# Altium schematic sheet Top Level.SchDoc
size A3; SheetNumber: 1; SheetTotal: 10
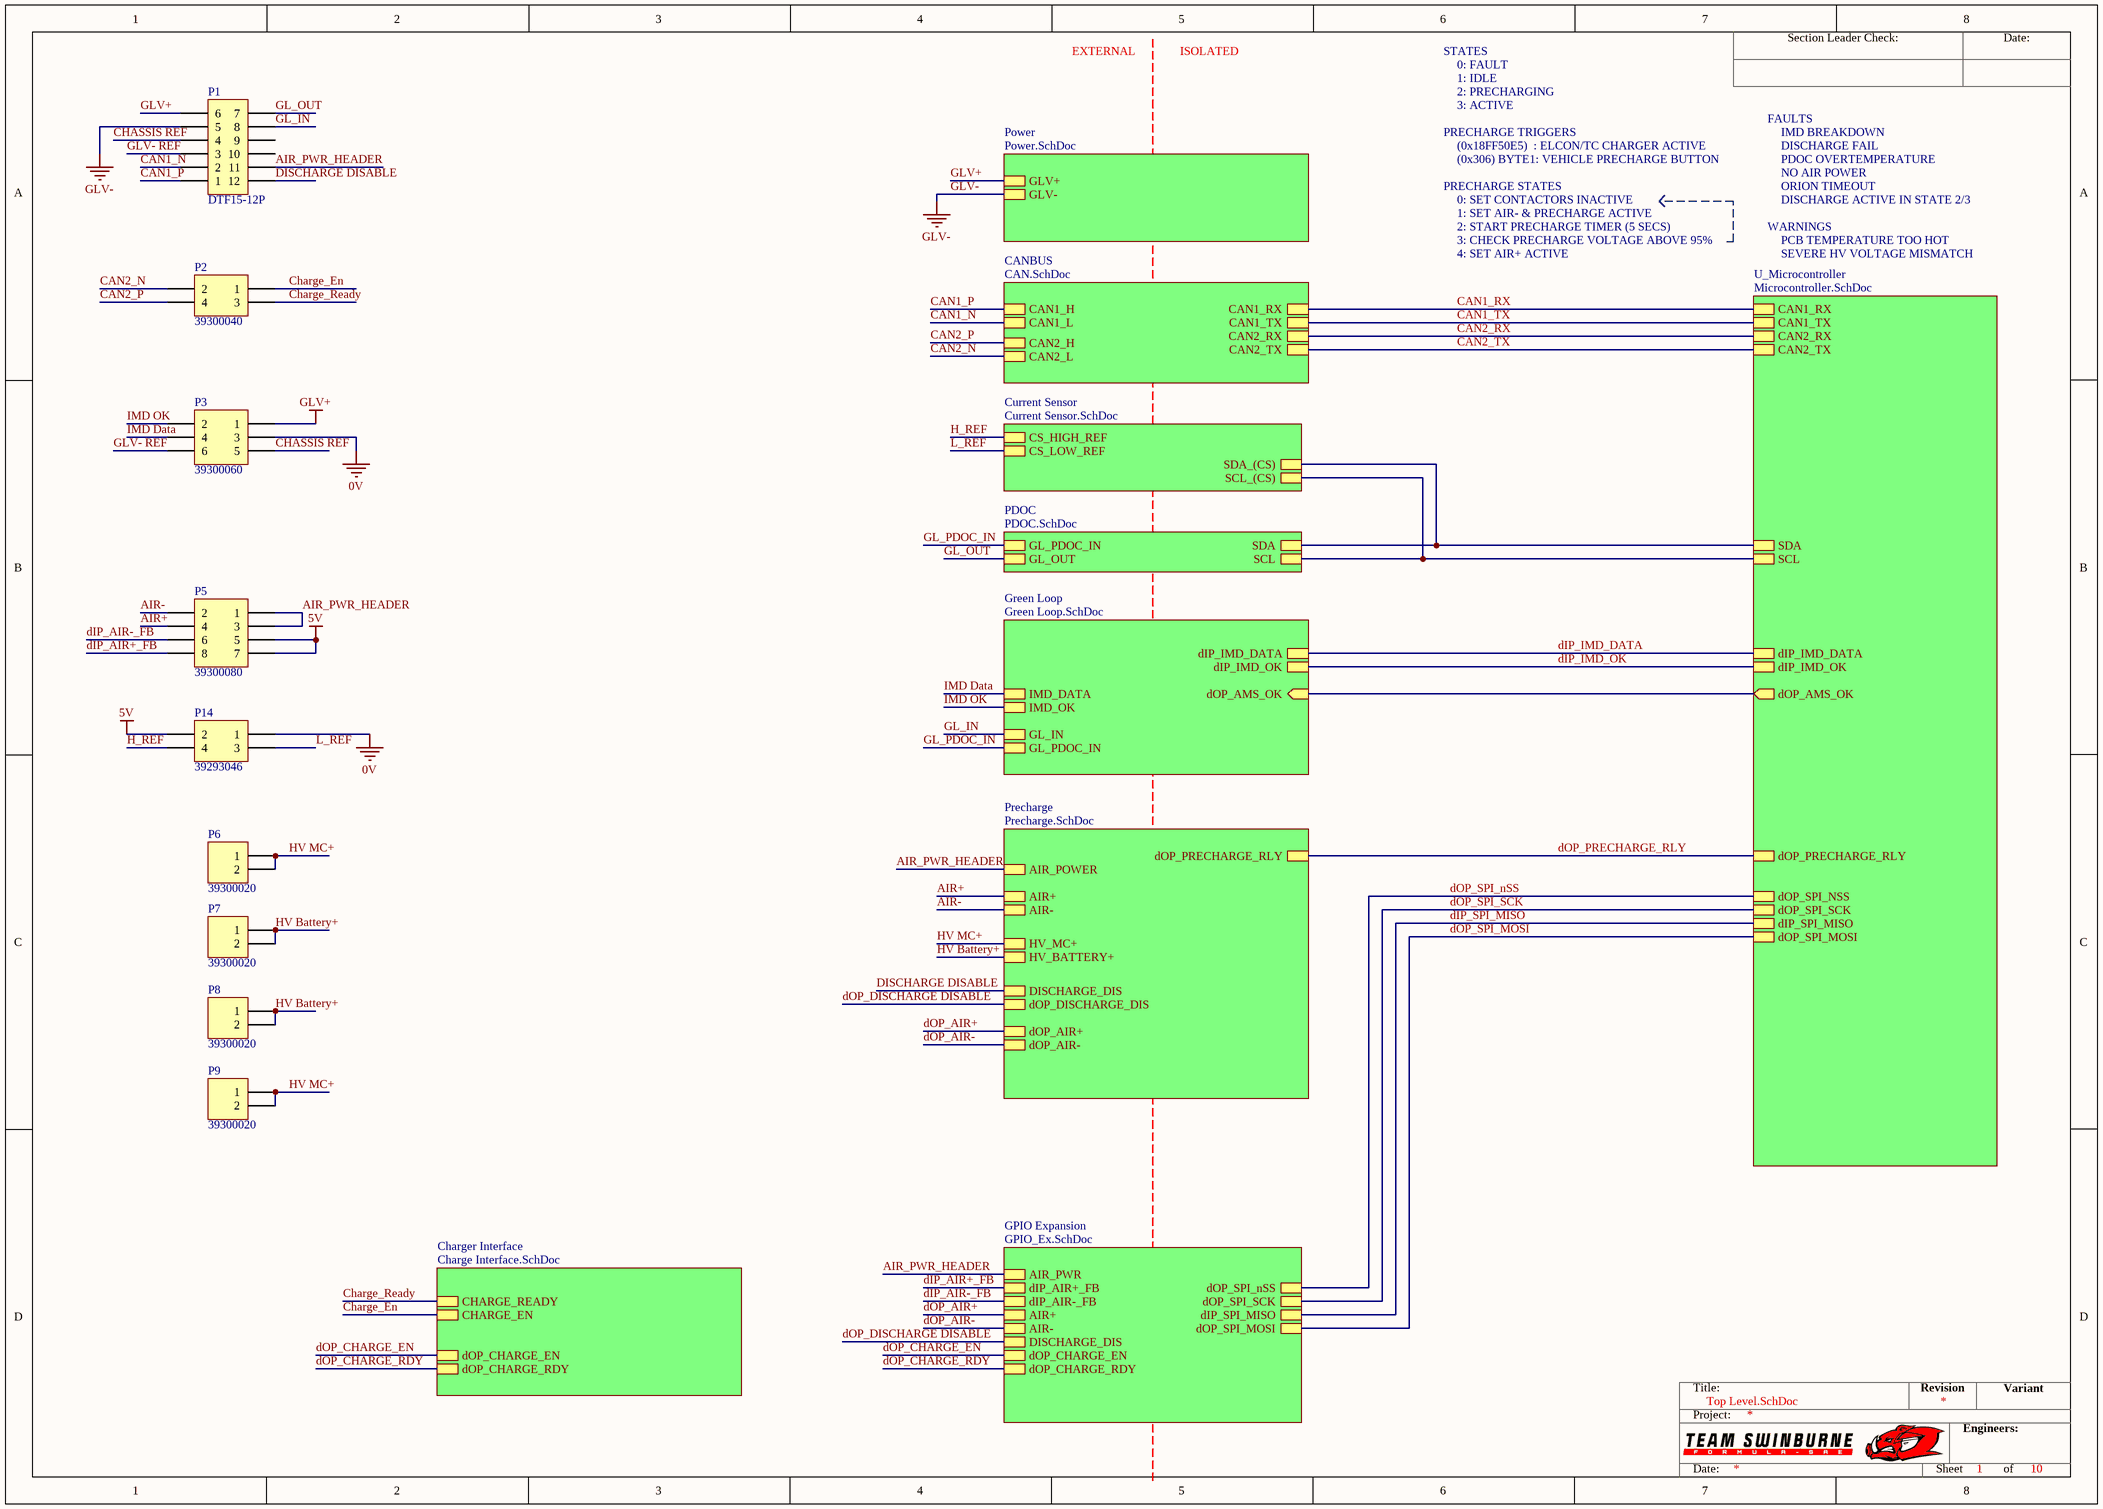
[diagram p0: Top Level.SchDoc]

## Parts
P1  DTF15-12P  [DTF15-12P]
P2  39300040  [39300040]
P3  39300060  [39300060]
P5  39300080  [39300080]
P6  39300020  [39300020]
P7  39300020  [39300020]
P8  39300020  [39300020]
P9  39300020  [39300020]
P14  39293046  [39293046]

## Sub-sheets
CANBUS = CAN.SchDoc: CAN1_RX, CAN1_TX, CAN2_RX, CAN2_TX, CAN1_H, CAN1_L, CAN2_H, CAN2_L
Charger Interface = Charge Interface.SchDoc: CHARGE_READY, CHARGE_EN, dOP_CHARGE_EN, dOP_CHARGE_RDY
Current Sensor = Current Sensor.SchDoc: SCL_(CS), CS_HIGH_REF, CS_LOW_REF, SDA_(CS)
GPIO Expansion = GPIO_Ex.SchDoc: dOP_SPI_nSS, dOP_SPI_SCK, dIP_SPI_MISO, dOP_SPI_MOSI, AIR_PWR, dIP_AIR+_FB, dIP_AIR-_FB, AIR+, AIR-, dOP_CHARGE_RDY, dOP_CHARGE_EN, DISCHARGE_DIS
Green Loop = Green Loop.SchDoc: dIP_IMD_DATA, dIP_IMD_OK, GL_IN, GL_PDOC_IN, IMD_DATA, IMD_OK, dOP_AMS_OK (in)
PDOC = PDOC.SchDoc: SDA, SCL, GL_PDOC_IN, GL_OUT
Power = Power.SchDoc: GLV+, GLV-
Precharge = Precharge.SchDoc: dOP_AIR-, dOP_AIR+, dOP_PRECHARGE_RLY, DISCHARGE_DIS, AIR+, AIR-, HV_MC+, HV_BATTERY+, dOP_DISCHARGE_DIS, AIR_POWER
U_Microcontroller = Microcontroller.SchDoc: CAN1_RX, CAN1_TX, CAN2_RX, CAN2_TX, dOP_PRECHARGE_RLY, dOP_SPI_NSS, dOP_SPI_SCK, dIP_SPI_MISO, dOP_SPI_MOSI, dIP_IMD_DATA, dIP_IMD_OK, SDA, SCL, dOP_AMS_OK (out)

## Nets
0V: P3.3 P14.1
5V: P5.5 P5.7 P14.2
GLV+: P1.6 P3.1 ; sheet Power/GLV+
GLV-: P1.5 ; sheet Power/GLV-
AIR+: P5.4 ; sheet Precharge/AIR+
AIR-: P5.2 ; sheet Precharge/AIR-
AIR_PWR_HEADER: P1.11 P5.1 P5.3 ; sheet Precharge/AIR_POWER, sheet GPIO Expansion/AIR_PWR
CAN1_N: P1.2 ; sheet CANBUS/CAN1_L
CAN1_P: P1.1 ; sheet CANBUS/CAN1_H
CAN1_RX: sheet U_Microcontroller/CAN1_RX, sheet CANBUS/CAN1_RX
CAN1_TX: sheet U_Microcontroller/CAN1_TX, sheet CANBUS/CAN1_TX
CAN2_N: P2.2 ; sheet CANBUS/CAN2_L
CAN2_P: P2.4 ; sheet CANBUS/CAN2_H
CAN2_RX: sheet U_Microcontroller/CAN2_RX, sheet CANBUS/CAN2_RX
CAN2_TX: sheet U_Microcontroller/CAN2_TX, sheet CANBUS/CAN2_TX
Charge_En: P2.1 ; sheet Charger Interface/CHARGE_EN
Charge_Ready: P2.3 ; sheet Charger Interface/CHARGE_READY
CHASSIS REF: P1.4 P3.5
dIP_AIR+_FB: P5.8 ; sheet GPIO Expansion/dIP_AIR+_FB
dIP_AIR-_FB: P5.6 ; sheet GPIO Expansion/dIP_AIR-_FB
dIP_IMD_DATA: sheet U_Microcontroller/dIP_IMD_DATA, sheet Green Loop/dIP_IMD_DATA
dIP_IMD_OK: sheet U_Microcontroller/dIP_IMD_OK, sheet Green Loop/dIP_IMD_OK
dIP_SPI_MISO: sheet U_Microcontroller/dIP_SPI_MISO, sheet GPIO Expansion/dIP_SPI_MISO
DISCHARGE DISABLE: P1.12 ; sheet Precharge/DISCHARGE_DIS
dOP_AIR+: sheet Precharge/dOP_AIR+, sheet GPIO Expansion/AIR+
dOP_AIR-: sheet Precharge/dOP_AIR-, sheet GPIO Expansion/AIR-
dOP_CHARGE_EN: sheet Charger Interface/dOP_CHARGE_EN, sheet GPIO Expansion/dOP_CHARGE_EN
dOP_CHARGE_RDY: sheet Charger Interface/dOP_CHARGE_RDY, sheet GPIO Expansion/dOP_CHARGE_RDY
dOP_DISCHARGE DISABLE: sheet Precharge/dOP_DISCHARGE_DIS, sheet GPIO Expansion/DISCHARGE_DIS
dOP_PRECHARGE_RLY: sheet U_Microcontroller/dOP_PRECHARGE_RLY, sheet Precharge/dOP_PRECHARGE_RLY
dOP_SPI_MOSI: sheet U_Microcontroller/dOP_SPI_MOSI, sheet GPIO Expansion/dOP_SPI_MOSI
dOP_SPI_nSS: sheet U_Microcontroller/dOP_SPI_NSS, sheet GPIO Expansion/dOP_SPI_nSS
dOP_SPI_SCK: sheet U_Microcontroller/dOP_SPI_SCK, sheet GPIO Expansion/dOP_SPI_SCK
GL_IN: P1.8 ; sheet Green Loop/GL_IN
GL_OUT: P1.7 ; sheet PDOC/GL_OUT
GL_PDOC_IN: sheet Green Loop/GL_PDOC_IN, sheet PDOC/GL_PDOC_IN
GLV- REF: P1.3 P3.6
H_REF: P14.4 ; sheet Current Sensor/CS_HIGH_REF
HV Battery+: P7.1 P7.2 P8.1 P8.2 ; sheet Precharge/HV_BATTERY+
HV MC+: P6.1 P6.2 P9.1 P9.2 ; sheet Precharge/HV_MC+
IMD Data: P3.4 ; sheet Green Loop/IMD_DATA
IMD OK: P3.2 ; sheet Green Loop/IMD_OK
L_REF: P14.3 ; sheet Current Sensor/CS_LOW_REF
(unnamed): sheet U_Microcontroller/SDA, sheet PDOC/SDA, sheet Current Sensor/SDA_(CS)
(unnamed): sheet U_Microcontroller/SCL, sheet PDOC/SCL, sheet Current Sensor/SCL_(CS)
(unnamed): sheet U_Microcontroller/dOP_AMS_OK, sheet Green Loop/dOP_AMS_OK

Not connected (* = marked no-connect by the designer): P1 9 10

## Notes on the sheet
- EXTERNAL
- ISOLATED
- STATES
- 0: FAULT
- 1: IDLE
- 2: PRECHARGING
- 3: ACTIVE
- PRECHARGE TRIGGERS
- (0x18FF50E5)  : ELCON/TC CHARGER ACTIVE
- (0x306) BYTE1: VEHICLE PRECHARGE BUTTON
- FAULTS
- IMD BREAKDOWN
- DISCHARGE FAIL
- PDOC OVERTEMPERATURE
- NO AIR POWER
- PRECHARGE STATES
- 1: SET AIR- & PRECHARGE ACTIVE
- 2: START PRECHARGE TIMER (5 SECS)
- 3: CHECK PRECHARGE VOLTAGE ABOVE 95%
- 0: SET CONTACTORS INACTIVE
- WARNINGS
- PCB TEMPERATURE TOO HOT
- ORION TIMEOUT
- DISCHARGE ACTIVE IN STATE 2/3
- 4: SET AIR+ ACTIVE
- SEVERE HV VOLTAGE MISMATCH
- Section Leader Check:
- Date:
- Title:
- Revision
- Variant
- Project:
- Engineers:
- Sheet
- of

## Library data of the parts
P1 = DTF15-12P: Positions: 12; Pitch: 4.44mm; Row Spacing: 9.12 mm; Angle: 0; Flange: No; Contact: Copper Alloy; Part Number: DTF15-12P; Digikey Part Number: 1734-1647-ND; Digikey Link: https://www.digikey.com.au/product-detail/en/te-connectivity-deutsch-connectors/DTF15-12PA/1734-1647-ND/7220164
P2 = 39300040: Pitch: 4.2mm; Row Spacing: 5.5mm; Angle: 90; Flange: No; Contact: Tin; Part Number: 39300040; Positions: 4; Digikey Part Number: WM21352-ND
P3 = 39300060: Pitch: 4.2mm; Row Spacing: 5.5mm; Angle: 90; Flange: No; Contact: Tin; Part Number: 39300060; Positions: 6; Digikey Part Number: WM21353-ND
P5 = 39300080: Pitch: 4.2mm; Row Spacing: 5.5mm; Angle: 90; Flange: No; Contact: Tin; Part Number: 39300080; Positions: 8; Digikey Part Number: WM21354-ND
P6-P9 = 39300020: Pitch: 4.2mm; Row Spacing: 5.5mm; Angle: 90; Flange: No; Contact: Tin; Part Number: 39300020; Positions: 2; Digikey Part Number: WM21351-ND
P14 = 39293046: Pitch: 4.2mm; Row Spacing: 5.5mm; Angle: 0; Flange: No; Contact: Tin; Part Number: 39293046; Positions: 4; Digikey Part Number: WM3844-ND